# Altium schematic sheet Arduino FPGA Power.SchDoc
size A4
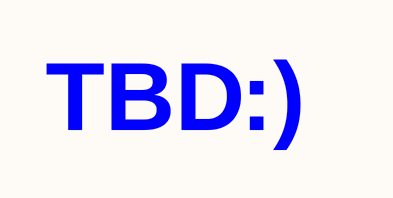
[diagram p0: Arduino FPGA Power.SchDoc]

## Notes on the sheet
- TBD
- :)